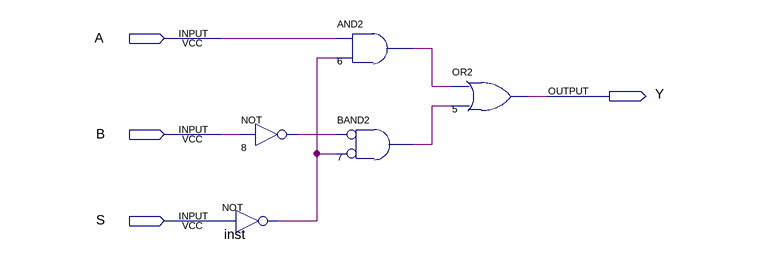
[diagram p0: schematic sheet]
// Quartus schematic mux21_1bit.bdf as structural Verilog: 5 symbols, 4 pins
module mux21_1bit (
  input  A,
  input  B,
  input  S,
  output Y
);

  wire inst_out, n6_out, n7_out, n8_out;

  not u_8 (n8_out, B);
  not inst (inst_out, S);
  and u_6 (n6_out, A, inst_out);
  and u_7 (n7_out, ~n8_out, ~inst_out);  // BAND2
  or u_5 (Y, n6_out, n7_out);
endmodule
